# EAGLE design working (EAGLE 6.5.0)
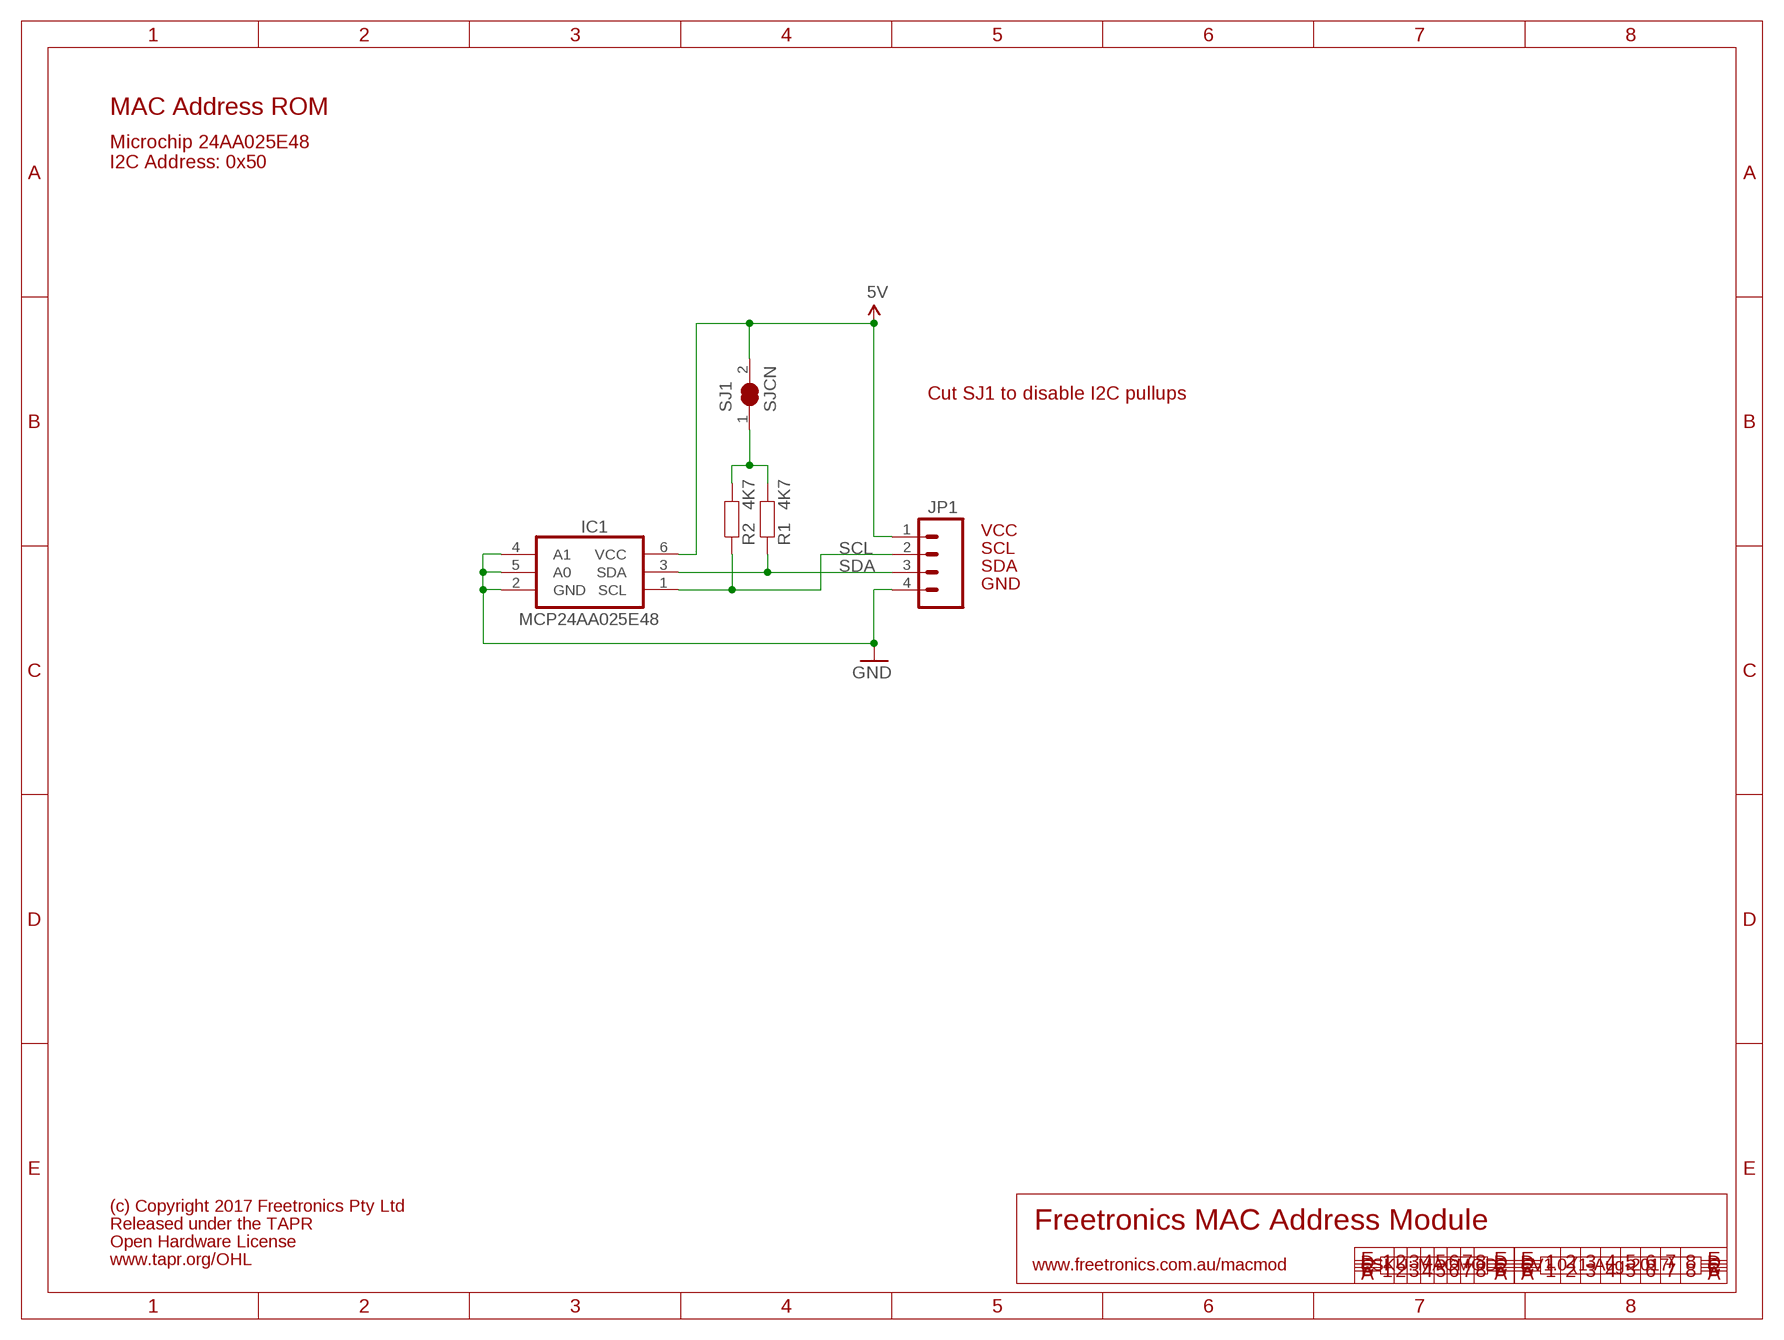
[diagram p0: schematic, sheet 1]

## Parts
IC1  MCP24AA025E48  [SOT23-6]
JP1  M04PTH  [1X04]
R1  4K7  RESISTOR0603  [0603]
R2  4K7  RESISTOR0603  [0603]
SJ1  SJCN  [SJC]

## Nets
5V: IC1.6(VCC) JP1.1 SJ1.2
GND: IC1.2(GND) IC1.4(A1) IC1.5(A0) JP1.4
N$1: R1.2 R2.2 SJ1.1
SCL: IC1.1(SCL) JP1.2 R2.1
SDA: IC1.3(SDA) JP1.3 R1.1

## Notes on the sheet
- MAC Address ROM
- Microchip 24AA025E48
  I2C Address: 0x50
- Cut SJ1 to disable I2C pullups
- VCC
- SCL
- SDA
- GND
- (c) Copyright 2017 Freetronics Pty Ltd
- Released under the TAPR | Freetronics MAC Address Module
- Open Hardware License
- www.tapr.org/OHL
- www.freetronics.com.au/macmod | SKU: MACMOD | V1.0 (1-Aug-2017)

## Library data of the parts
IC1 = freetronics-jon:MCP24AA025E48
JP1 = freetronics-master-v1.1:M04: Header 4 Standard 4-pin 0.1" header. Use with straight break away headers (SKU : PRT-00116), right angle break away headers (PRT-00553), swiss pins (PRT-00743), machine pins (PRT-00117), and female headers (PRT-00115). Molex polarized connector foot print use with SKU : PRT-08231 with associated crimp pins and housings.
R1 R2 = freetronics-jon:RESISTOR: Resistor Basic schematic elements and footprints for 0603, 1206, and PTH 1/10th watt (small) resistors.
SJ1 = freetronics-jon:SJC

## Board
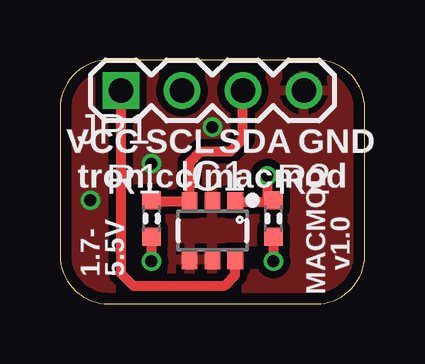
[diagram p1: board, top side]
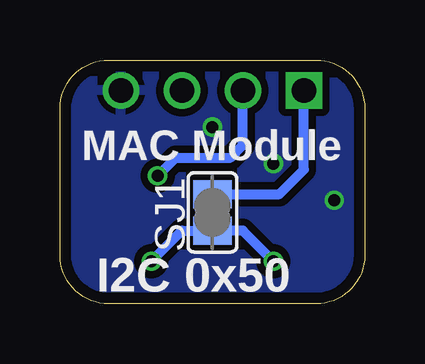
[diagram p2: board, bottom side, seen from below]

Size 12.7 x 10.16 mm. Coordinates in mm from the lower left corner, seen from the top.
Outline: 0,2.03 arc90 2.03,0 10.67,0 arc90 12.7,2.03 12.7,8.13 arc90 10.67,10.16 2.03,10.16 arc90 0,8.13 0,2.03
Copper layers (1*16): Top 0.035mm / dielectric 1.5mm / Bottom 0.035mm
Design rules "default *": minimum track width 10mil, minimum drill 24mil, track to track 12mil, track to pad 12mil, pad to pad 12mil, via to via 12mil, smd to smd 8mil, copper to edge 18mil, drill to drill 8mil, minimum pad ring 8mil, minimum via ring 6mil, stop-mask expansion 4mil, vias tented up to drill 0mil, thermal gap 10mil

### Footprints (pad centres in the part's own frame; a part is rotated, then mirrored left to right if it is on the bottom)
SOT23-6 = smd 0.65 x 0.8: 1 -0.95,-1.2; 2 0,-1.2; 3 0.95,-1.2; 4 0.95,1.2; 5 0,1.2; 6 -0.95,1.2
1X04 = drill 1.016 square: 1 0,0 | drill 1.016: 2 2.54,0; 3 5.08,0; 4 7.62,0
0603 = smd 0.762 x 0.762: 1 -0.762,0; 2 0.762,0
SJC = smd 1.168 x 1.6: 1 -0.762,0; 2 0.762,0

### Placement (x,y rotation side)
IC1  6.35,3.05 180 top
JP1  2.54,8.89 0 top
R1  3.81,3.56 270 top
R2  8.89,3.56 270 top
SJ1  6.35,3.81 90 bottom

### Tracks (layer width: path | path; a pad name or v marks a point on that pad's centre or on a via)
5V
  Top 0.406: JP1.1 2.54,1.27 3.05,0.76 6.86,0.76 7.3,1.2 IC1.6
  Bottom 0.406: SJ1.2 3.56,4.57 2.54,5.59 JP1.1
GND  (via drill 0.5)
  other vias: 1.27,4.32 6.35,7.37 3.81,5.84
  pour Bottom: 0,8.13 arc-90 2.03,10.16 10.67,10.16 arc-90 12.7,8.13 12.7,2.03 arc-90 10.67,0 2.03,0 arc-90 0,2.03
  pour Top: 0,8.13 arc-90 2.03,10.16 10.67,10.16 arc-90 12.7,8.13 12.7,2.03 arc-90 10.67,0 2.03,0 arc-90 0,2.03
N$1  (via drill 0.5)
  Top 0.406: R1.2 v3.81,1.78 | R2.2 v8.89,1.78
  Bottom 0.406: v3.81,1.78 5.08,3.05 SJ1.1 7.62,3.05 v8.89,1.78
SCL  (via drill 0.5)
  Top 0.406: 7.81,4.25 7.55,4.25 IC1.1 9.07,4.25 8.64,4.32 | v8.64,5.33 8.64,4.32 | 8.64,4.32 R2.1
  Bottom 0.406: v8.64,5.33 7.87,6.1 5.59,6.1 5.08,6.6 JP1.2
SDA
  Top 0.406: R1.1 4.25,4.25 IC1.3 5.4,5.91 5.84,6.35 7.11,6.35 7.62,6.86 JP1.3

### Text on the board
tPlace: VCC | SCL | SDA | GND | tron.cc/macmod | 1.7- | 5.5V | v1.0 | MACMOD
bPlace: MAC Module | I2C 0x50
tDocu: 1